# EAGLE design second (EAGLE 9.6.2)
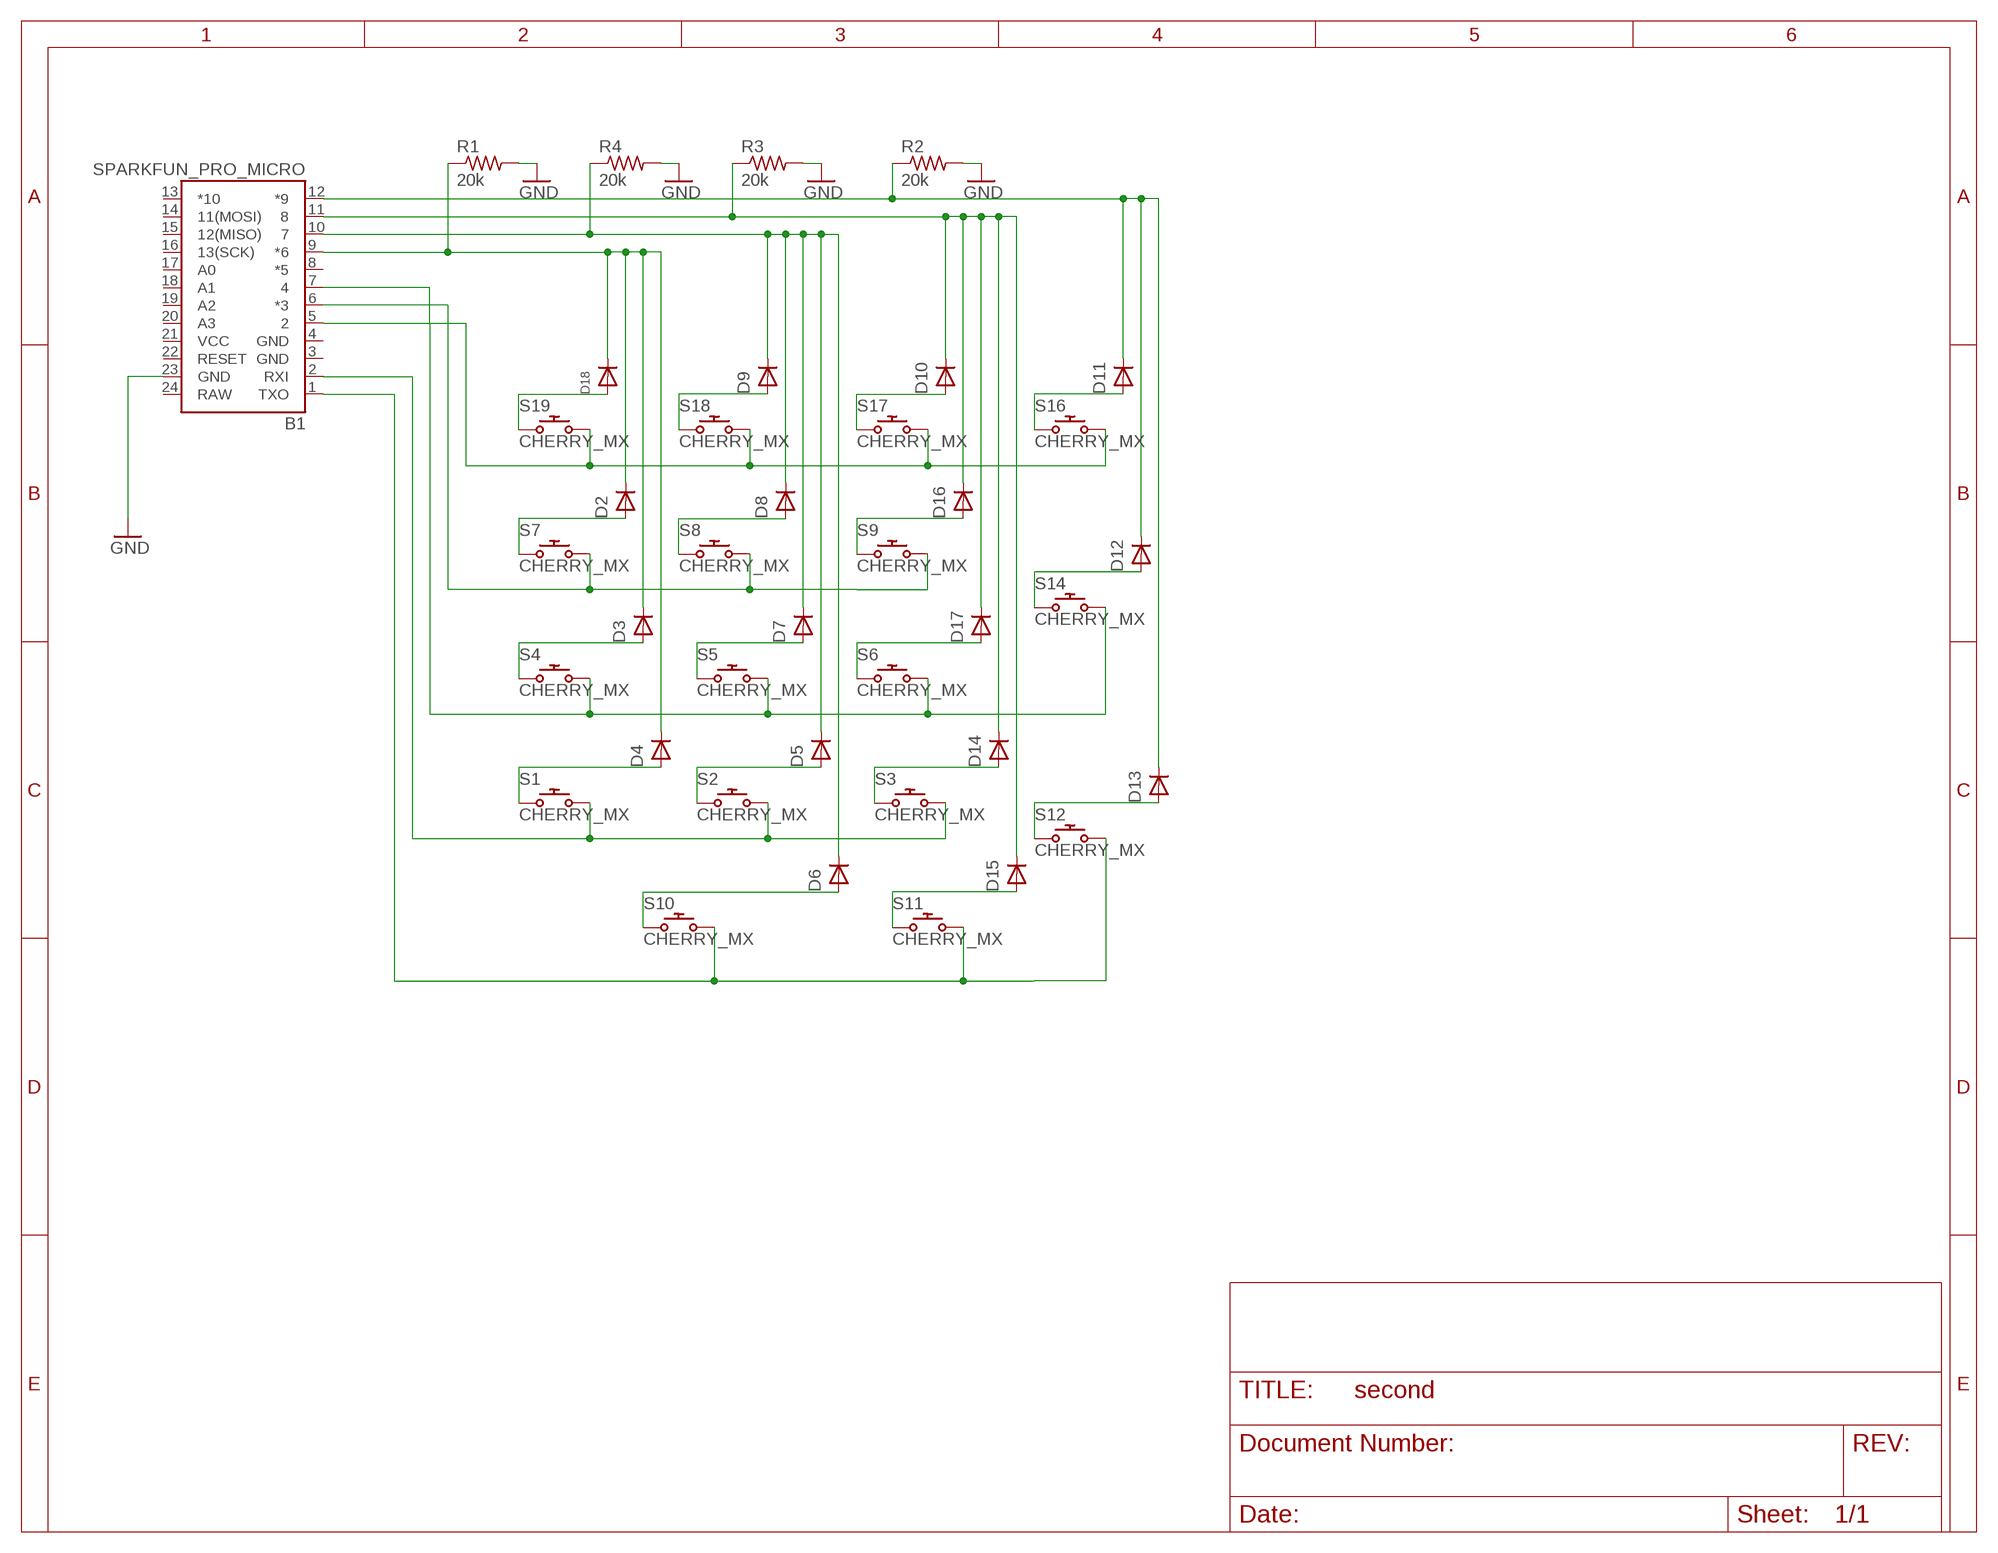
[diagram p0: schematic, sheet 1]

## Parts
B1  SPARKFUN_PRO_MICRO  [SPARKFUN_PRO_MICRO]
D2  DIODESOD-123  [SOD-123]
D3  DIODESOD-123  [SOD-123]
D4  DIODESOD-123  [SOD-123]
D5  DIODESOD-123  [SOD-123]
D6  DIODESOD-123  [SOD-123]
D7  DIODESOD-123  [SOD-123]
D8  DIODESOD-123  [SOD-123]
D9  DIODESOD-123  [SOD-123]
D10  DIODESOD-123  [SOD-123]
D11  DIODESOD-123  [SOD-123]
D12  DIODESOD-123  [SOD-123]
D13  DIODESOD-123  [SOD-123]
D14  DIODESOD-123  [SOD-123]
D15  DIODESOD-123  [SOD-123]
D16  DIODESOD-123  [SOD-123]
D17  DIODESOD-123  [SOD-123]
D18  DIODESOD-123  [SOD-123]
R1  20k  R-US_R0805  [R0805]
R2  20k  R-US_R0805  [R0805]
R3  20k  R-US_R0805  [R0805]
R4  20k  R-US_R0805  [R0805]
S1  CHERRY_MX  [CHERRY_MX]
S2  CHERRY_MX  [CHERRY_MX]
S3  CHERRY_MX  [CHERRY_MX]
S4  CHERRY_MX  [CHERRY_MX]
S5  CHERRY_MX  [CHERRY_MX]
S6  CHERRY_MX  [CHERRY_MX]
S7  CHERRY_MX  [CHERRY_MX]
S8  CHERRY_MX  [CHERRY_MX]
S9  CHERRY_MX  [CHERRY_MX]
S10  CHERRY_MX  [CHERRY_MX]
S11  CHERRY_MX  [CHERRY_MX]
S12  CHERRY_MX  [CHERRY_MX]
S14  CHERRY_MX  [CHERRY_MX]
S16  CHERRY_MX  [CHERRY_MX]
S17  CHERRY_MX  [CHERRY_MX]
S18  CHERRY_MX  [CHERRY_MX]
S19  CHERRY_MX  [CHERRY_MX]

## Nets
GND: B1.23(GND) R1.2 R2.2 R3.2 R4.2
N$1: D3.A S4.S1
N$2: D2.A S7.S1
N$3: D6.A S10.S1
N$4: D4.A S1.S1
N$5: D7.A S5.S1
N$6: D8.A S8.S1
N$7: D15.A S11.S1
N$8: D16.A S9.S1
N$9: D17.A S6.S1
N$10: D5.A S2.S1
N$11: D14.A S3.S1
N$12: D13.A S12.S1
N$13: D10.A S17.S1
N$14: D12.A S14.S1
N$15: D9.A S18.S1
N$16: B1.9(*6) D2.C D3.C D4.C D18.C R1.1
N$17: D18.A S19.S1
N$18: D11.A S16.S1
N$19: B1.1(TXO) S10.S2 S11.S2 S12.S2
N$20: B1.2(RXI) S1.S2 S2.S2 S3.S2
N$21: B1.7 S4.S2 S5.S2 S6.S2 S14.S2
N$22: B1.6(*3) S7.S2 S8.S2 S9.S2
N$23: B1.5 S16.S2 S17.S2 S18.S2 S19.S2
N$25: B1.10 D5.C D6.C D7.C D8.C D9.C R4.1
N$26: B1.11 D10.C D14.C D15.C D16.C D17.C R3.1
N$27: B1.12(*9) D11.C D12.C D13.C R2.1
Unconnected: B1.8(*5) B1.13(*10) B1.14(11(MOSI)) B1.15(12(MISO)) B1.16(13(SCK)) B1.17(A0) B1.18(A1) B1.19(A2) B1.20(A3) B1.22(RESET)

## Power pins joined to a net without a drawn wire
GND: B1.3(GND) B1.4(GND)
RAW: B1.24(RAW)
VCC: B1.21(VCC)

## Library data of the parts
B1 = SparkFun-Boards:SPARKFUN_PRO_MICRO: SparkFun Pro Micro Atmega32U4 compatible footprint. SparkFun Products: 3.3V/8MHz <https://www.sparkfun.com/products/12587> 5V/16MHz <https://www.sparkfun.com/products/12640>
D2-D18 = adafruit:DIODE: Diode SMADIODE - SMA Surface Mount Package 20V 1A Schottky Diode Digikey: 641-1014-6-ND DO-1N4148 - Through Hole Small Current Diode SOD-123 20V 1 A (.5mV Vf) Schottky Diode - Digikey: MBRX120TPMSCT-ND SOD-323 10V 570mA (.38mV Vf, 3ns) Schottky Diode - Digikey: ZLLS410CT-ND SOD-523 30V 30mA Schottky Diode (RB751S-40TE61) - Digikey: RB751S-40TE61CT-ND SOT23-R/W - SOT23 Package (R = Solder Paste/Reflow Ovens, W = Hand-Soldering) BAT54Film 40V 300mA - Digikey: 497-7162-1-ND
R1-R4 = rcl:R-US_: RESISTOR, American symbol; SPICEPREFIX: R
S1-S12 S14 S16-S19 = cherry:CHERRY_MX: Cherry keymodule MX; FARNELL: 2292961; MOUSER: 540-MX1A-11NW

## Board
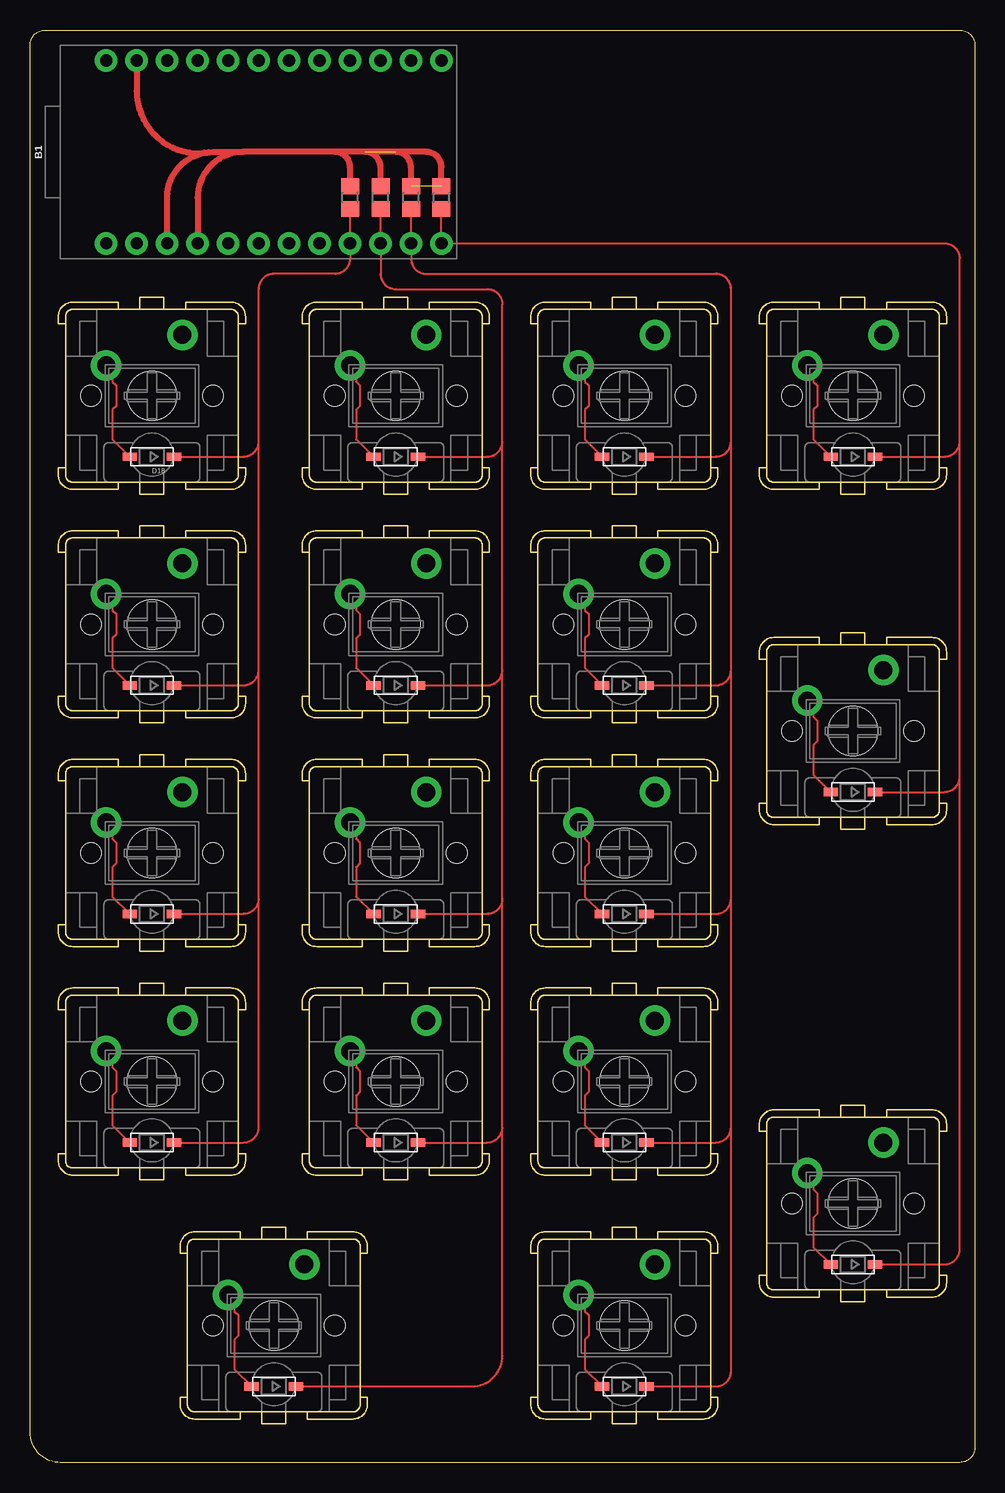
[diagram p1: board, top side]
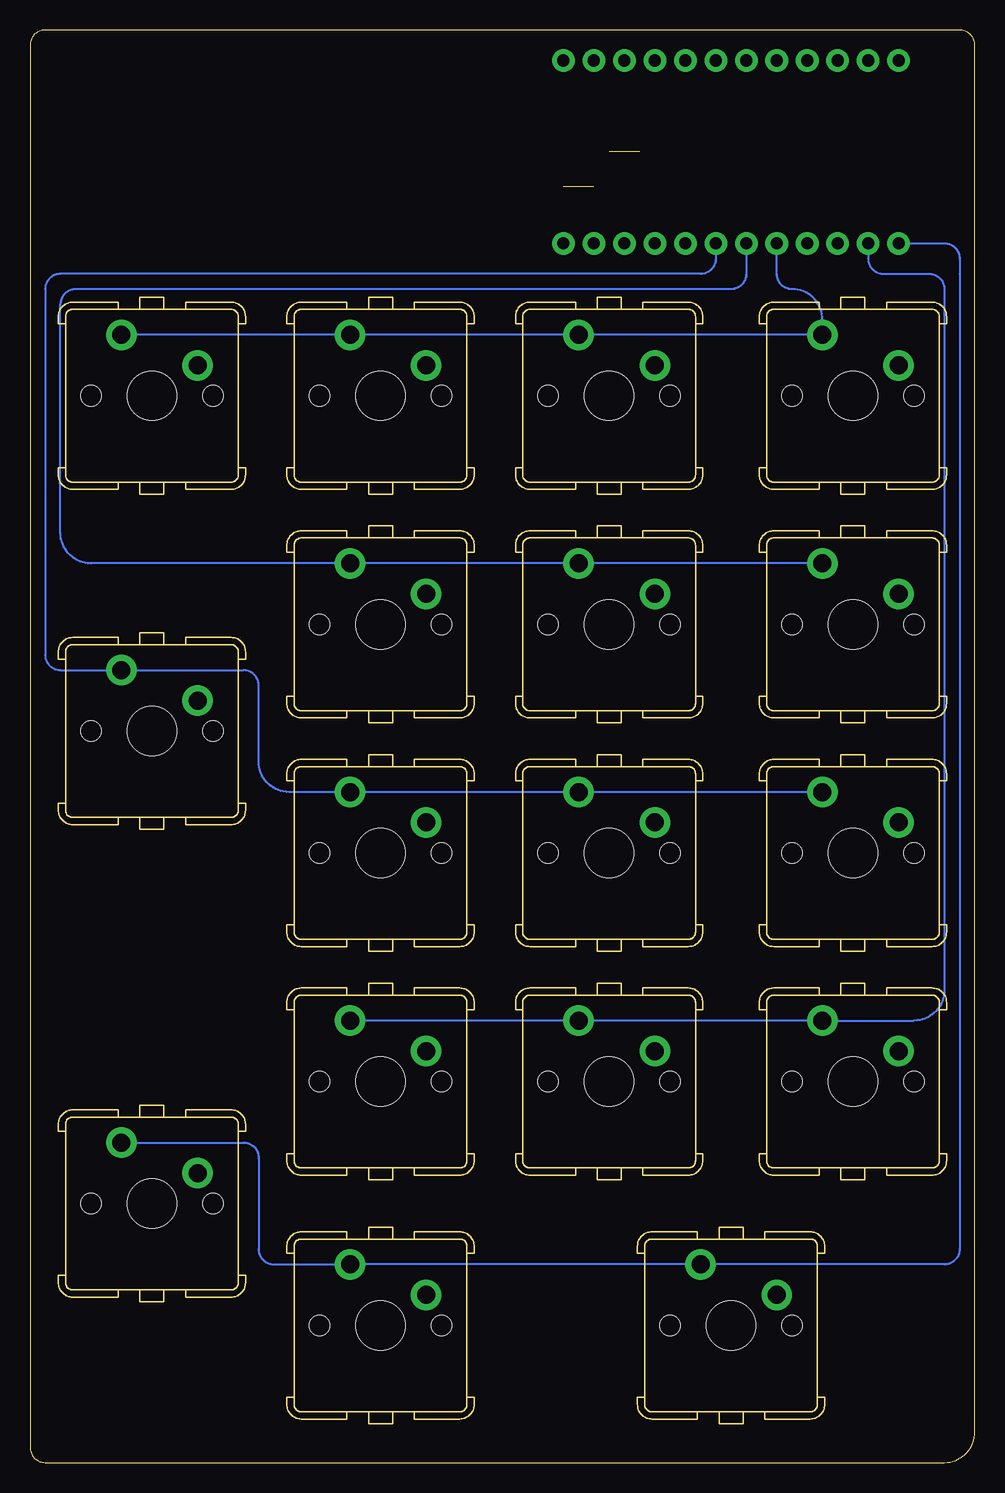
[diagram p2: board, bottom side, seen from below]

Size 78.74 x 119.38 mm. Coordinates in mm from the lower left corner, seen from the top.
Outline: 0,5.08 0,118.11 arc-90 1.27,119.38 77.47,119.38 arc-90 78.74,118.11 78.74,1.27 arc-90 77.47,0 2.54,0 arc-90 0,2.54 0,5.08
Copper layers (1*16): Top 0.035mm / dielectric 1.5mm / Bottom 0.035mm
Design rules "default": minimum track width 6mil, minimum drill 0.35mm, track to track 6mil, track to pad 6mil, pad to pad 6mil, via to via 6mil, smd to smd 6mil, copper to edge 40mil, drill to drill 6mil, minimum pad ring 10mil, minimum via ring 8mil, stop-mask expansion 4mil, vias tented up to drill 0mil, thermal gap 10mil

### Footprints (pad centres in the part's own frame; a part is rotated, then mirrored left to right if it is on the bottom)
SPARKFUN_PRO_MICRO = drill 1.016 pad 1.88: 1 -7.62,12.7; 2 -7.62,10.16; 3 -7.62,7.62; 4 -7.62,5.08; 5 -7.62,2.54; 6 -7.62,0; 7 -7.62,-2.54; 8 -7.62,-5.08; 9 -7.62,-7.62; 10 -7.62,-10.16; 11 -7.62,-12.7; 12 -7.62,-15.24; 13 7.62,-15.24; 14 7.62,-12.7; 15 7.62,-10.16; 16 7.62,-7.62; 17 7.62,-5.08; 18 7.62,-2.54; 19 7.62,0; 20 7.62,2.54; 21 7.62,5.08; 22 7.62,7.62; 23 7.62,10.16; 24 7.62,12.7
SOD-123 = smd 1.2 x 0.7: A 1.85,0; C -1.85,0
R0805 = smd 1.3 x 1.5: 1 -0.95,0; 2 0.95,0
CHERRY_MX = drill 1.5 pad 2.54: S1 -3.81,2.54; S2 2.54,5.08 | hole 1.7: -5.08,0; 5.08,0 | hole 4.1: 0,0

### Placement (x,y rotation side)
B1  19.05,109.22 90 top
D2  10.16,64.77 180 top
D3  10.16,45.72 180 top
D4  10.16,26.67 180 top
D5  30.48,26.67 180 top
D6  20.32,6.35 180 top
D7  30.48,45.72 180 top
D8  30.48,64.77 180 top
D9  30.48,83.82 180 top
D10  49.53,83.82 180 top
D11  68.58,83.82 180 top
D12  68.58,55.88 180 top
D13  68.58,16.51 180 top
D14  49.53,26.67 180 top
D15  49.53,6.35 180 top
D16  49.53,64.77 180 top
D17  49.53,45.72 180 top
D18  10.16,83.82 180 top
R1  26.67,105.41 90 top
R2  34.29,105.41 90 top
R3  31.75,105.41 90 top
R4  29.21,105.41 90 top
S1  10.16,31.75 0 top
S2  30.48,31.75 0 top
S3  49.53,31.75 0 top
S4  10.16,50.8 0 top
S5  30.48,50.8 0 top
S6  49.53,50.8 0 top
S7  10.16,69.85 0 top
S8  30.48,69.85 0 top
S9  49.53,69.85 0 top
S10  20.32,11.43 0 top
S11  49.53,11.43 0 top
S12  68.58,21.59 0 top
S14  68.58,60.96 0 top
S16  68.58,88.9 0 top
S17  49.53,88.9 0 top
S18  30.48,88.9 0 top
S19  10.16,88.9 0 top

### Tracks (layer width: path | path; a pad name or v marks a point on that pad's centre or on a via)
GND  (2 unrouted)
  Top 0.508: R1.2 26.67,107.95 arc90 25.4,109.22 | R4.2 29.21,107.95 arc90 27.94,109.22 | R3.2 31.75,107.95 arc90 30.48,109.22 | R2.2 34.29,107.95 arc90 33.02,109.22 25.4,109.22 | 25.4,109.22 17.78,109.22 | 17.78,109.22 arc90 13.97,105.41 B1.4 | B1.3 11.43,105.41 arc-90 15.24,109.22 | 15.24,109.22 17.78,109.22 | B1.23 8.89,114.3 arc103 15.24,109.22
N$1
  Top 0.152: S4.S1 6.87,52.83 6.87,51.98 7.17,51.67 7.17,49.93 6.87,49.62 6.87,47.16 D3.A
N$2
  Top 0.152: S7.S1 6.87,71.88 6.87,71.03 7.17,70.72 7.17,68.98 6.87,68.67 6.87,66.22 D2.A
N$3
  Top 0.152: S10.S1 17.02,13.46 17.02,12.61 17.34,12.3 17.34,10.56 17.02,10.25 17.02,7.79 D6.A
N$4
  Top 0.152: S1.S1 6.87,33.77 6.87,32.93 7.17,32.62 7.17,30.88 6.87,30.57 6.87,28.11 D4.A
N$5
  Top 0.152: S5.S1 27.18,52.83 27.18,51.98 27.5,51.67 27.5,49.93 27.18,49.62 27.18,47.16 D7.A
N$6
  Top 0.152: S8.S1 27.18,71.88 27.18,71.03 27.5,70.72 27.5,68.98 27.18,68.67 27.18,66.22 D8.A
N$7
  Top 0.152: S11.S1 46.23,13.46 46.23,12.61 46.55,12.3 46.55,10.56 46.23,10.25 46.23,7.79 D15.A
N$8
  Top 0.152: S9.S1 46.23,71.88 46.23,71.03 46.55,70.72 46.55,68.98 46.23,68.67 46.23,66.22 D16.A
N$9
  Top 0.152: S6.S1 46.23,52.83 46.23,51.98 46.55,51.67 46.55,49.93 46.23,49.62 46.23,47.16 D17.A
N$10
  Top 0.152: S2.S1 27.18,33.77 27.18,32.93 27.5,32.62 27.5,30.88 27.18,30.57 27.18,28.11 D5.A
N$11
  Top 0.152: S3.S1 46.23,33.77 46.23,32.93 46.55,32.62 46.55,30.88 46.23,30.57 46.23,28.11 D14.A
N$12
  Top 0.152: S12.S1 65.28,23.61 65.28,22.77 65.59,22.46 65.59,20.72 65.28,20.41 65.28,17.95 D13.A
N$13
  Top 0.152: S17.S1 46.23,90.92 46.23,90.08 46.55,89.77 46.55,88.03 46.23,87.72 46.23,85.27 D10.A
N$14
  Top 0.152: S14.S1 65.28,62.98 65.28,62.14 65.59,61.83 65.59,60.09 65.28,59.78 65.28,57.33 D12.A
N$15
  Top 0.152: S18.S1 27.18,90.92 27.18,90.08 27.5,89.77 27.5,88.03 27.18,87.72 27.18,85.27 D9.A
N$16
  Top 0.152: D4.C 17.78,26.67 arc90 19.05,27.94 19.05,46.99 | D3.C 17.78,45.72 arc90 19.05,46.99 | D2.C 17.78,64.77 arc90 19.05,66.04 | 19.05,46.99 19.05,66.04 | 19.05,85.09 arc-90 17.78,83.82 D18.C | 19.05,66.04 19.05,85.09 | R1.1 B1.9 26.67,100.33 arc-90 25.4,99.06 20.32,99.06 arc90 19.05,97.79 19.05,85.09
N$17
  Top 0.152: S19.S1 6.87,90.92 6.87,90.08 7.17,89.77 7.17,88.03 6.87,87.72 6.87,85.27 D18.A
N$18
  Top 0.152: S16.S1 65.28,90.92 65.28,90.08 65.59,89.77 65.59,88.03 65.28,87.72 65.28,85.27 D11.A
N$19
  Bottom 0.152: S12.S2 60.96,26.67 arc90 59.69,25.4 59.69,17.78 arc-90 58.42,16.51 S11.S2 S10.S2 2.54,16.51 arc-90 1.27,17.78 1.27,99.06 1.27,100.33 arc-90 2.54,101.6 B1.1
N$20
  Bottom 0.152: S3.S2 S2.S2 S1.S2 5.08,36.83 arc-90 2.54,39.37 2.54,97.79 arc-90 3.81,99.06 7.62,99.06 arc90 8.89,100.33 B1.2
N$21
  Bottom 0.152: S4.S2 S5.S2 S6.S2 57.15,55.88 arc90 59.69,58.42 59.69,64.77 arc-90 60.96,66.04 S14.S2 76.2,66.04 arc90 77.47,67.31 77.47,97.79 arc90 76.2,99.06 22.86,99.06 arc-90 21.59,100.33 B1.7
N$22
  Bottom 0.152: S7.S2 S8.S2 S9.S2 73.66,74.93 arc90 76.2,77.47 76.2,96.52 arc90 74.93,97.79 20.32,97.79 arc-90 19.05,99.06 B1.6
N$23
  Bottom 0.152: S18.S2 S19.S2 12.7,95.25 arc-90 15.24,97.79 arc90 16.51,99.06 B1.5 | S18.S2 S17.S2 S16.S2 | 31.75,93.98 S18.S2
N$25
  Top 0.152: D6.C 36.83,6.35 arc90 39.37,8.89 39.37,27.94 | D5.C 38.1,26.67 arc90 39.37,27.94 | D7.C 38.1,45.72 arc90 39.37,46.99 | 39.37,27.94 39.37,46.99 | D8.C 38.1,64.77 arc90 39.37,66.04 | 39.37,46.99 39.37,66.04 | D9.C 38.1,83.82 arc90 39.37,85.09 | 39.37,66.04 39.37,85.09 | R4.1 B1.10 29.21,99.06 arc90 30.48,97.79 38.1,97.79 arc-90 39.37,96.52 39.37,85.09
N$26
  Top 0.152: D10.C 57.15,83.82 arc90 58.42,85.09 | D16.C 57.15,64.77 arc90 58.42,66.04 | 58.42,66.04 58.42,85.09 | D17.C 57.15,45.72 arc90 58.42,46.99 | 58.42,46.99 58.42,66.04 | D14.C 57.15,26.67 arc90 58.42,27.94 | 58.42,27.94 58.42,46.99 | D15.C 57.15,6.35 arc90 58.42,7.62 58.42,27.94 | R3.1 B1.11 31.75,100.33 arc90 33.02,99.06 57.15,99.06 arc-90 58.42,97.79 58.42,85.09
N$27
  Top 0.152: D11.C 76.2,83.82 arc90 77.47,85.09 | D12.C 76.2,55.88 arc90 77.47,57.15 | 77.47,57.15 77.47,85.09 | D13.C 76.2,16.51 arc90 77.47,17.78 77.47,57.15 | R2.1 B1.12 76.2,101.6 arc-90 77.47,100.33 77.47,85.09

### Text on the board
_tsilk: Andre's Numpad / v 0.1